# EAGLE design word_clock (EAGLE 7.4.0)
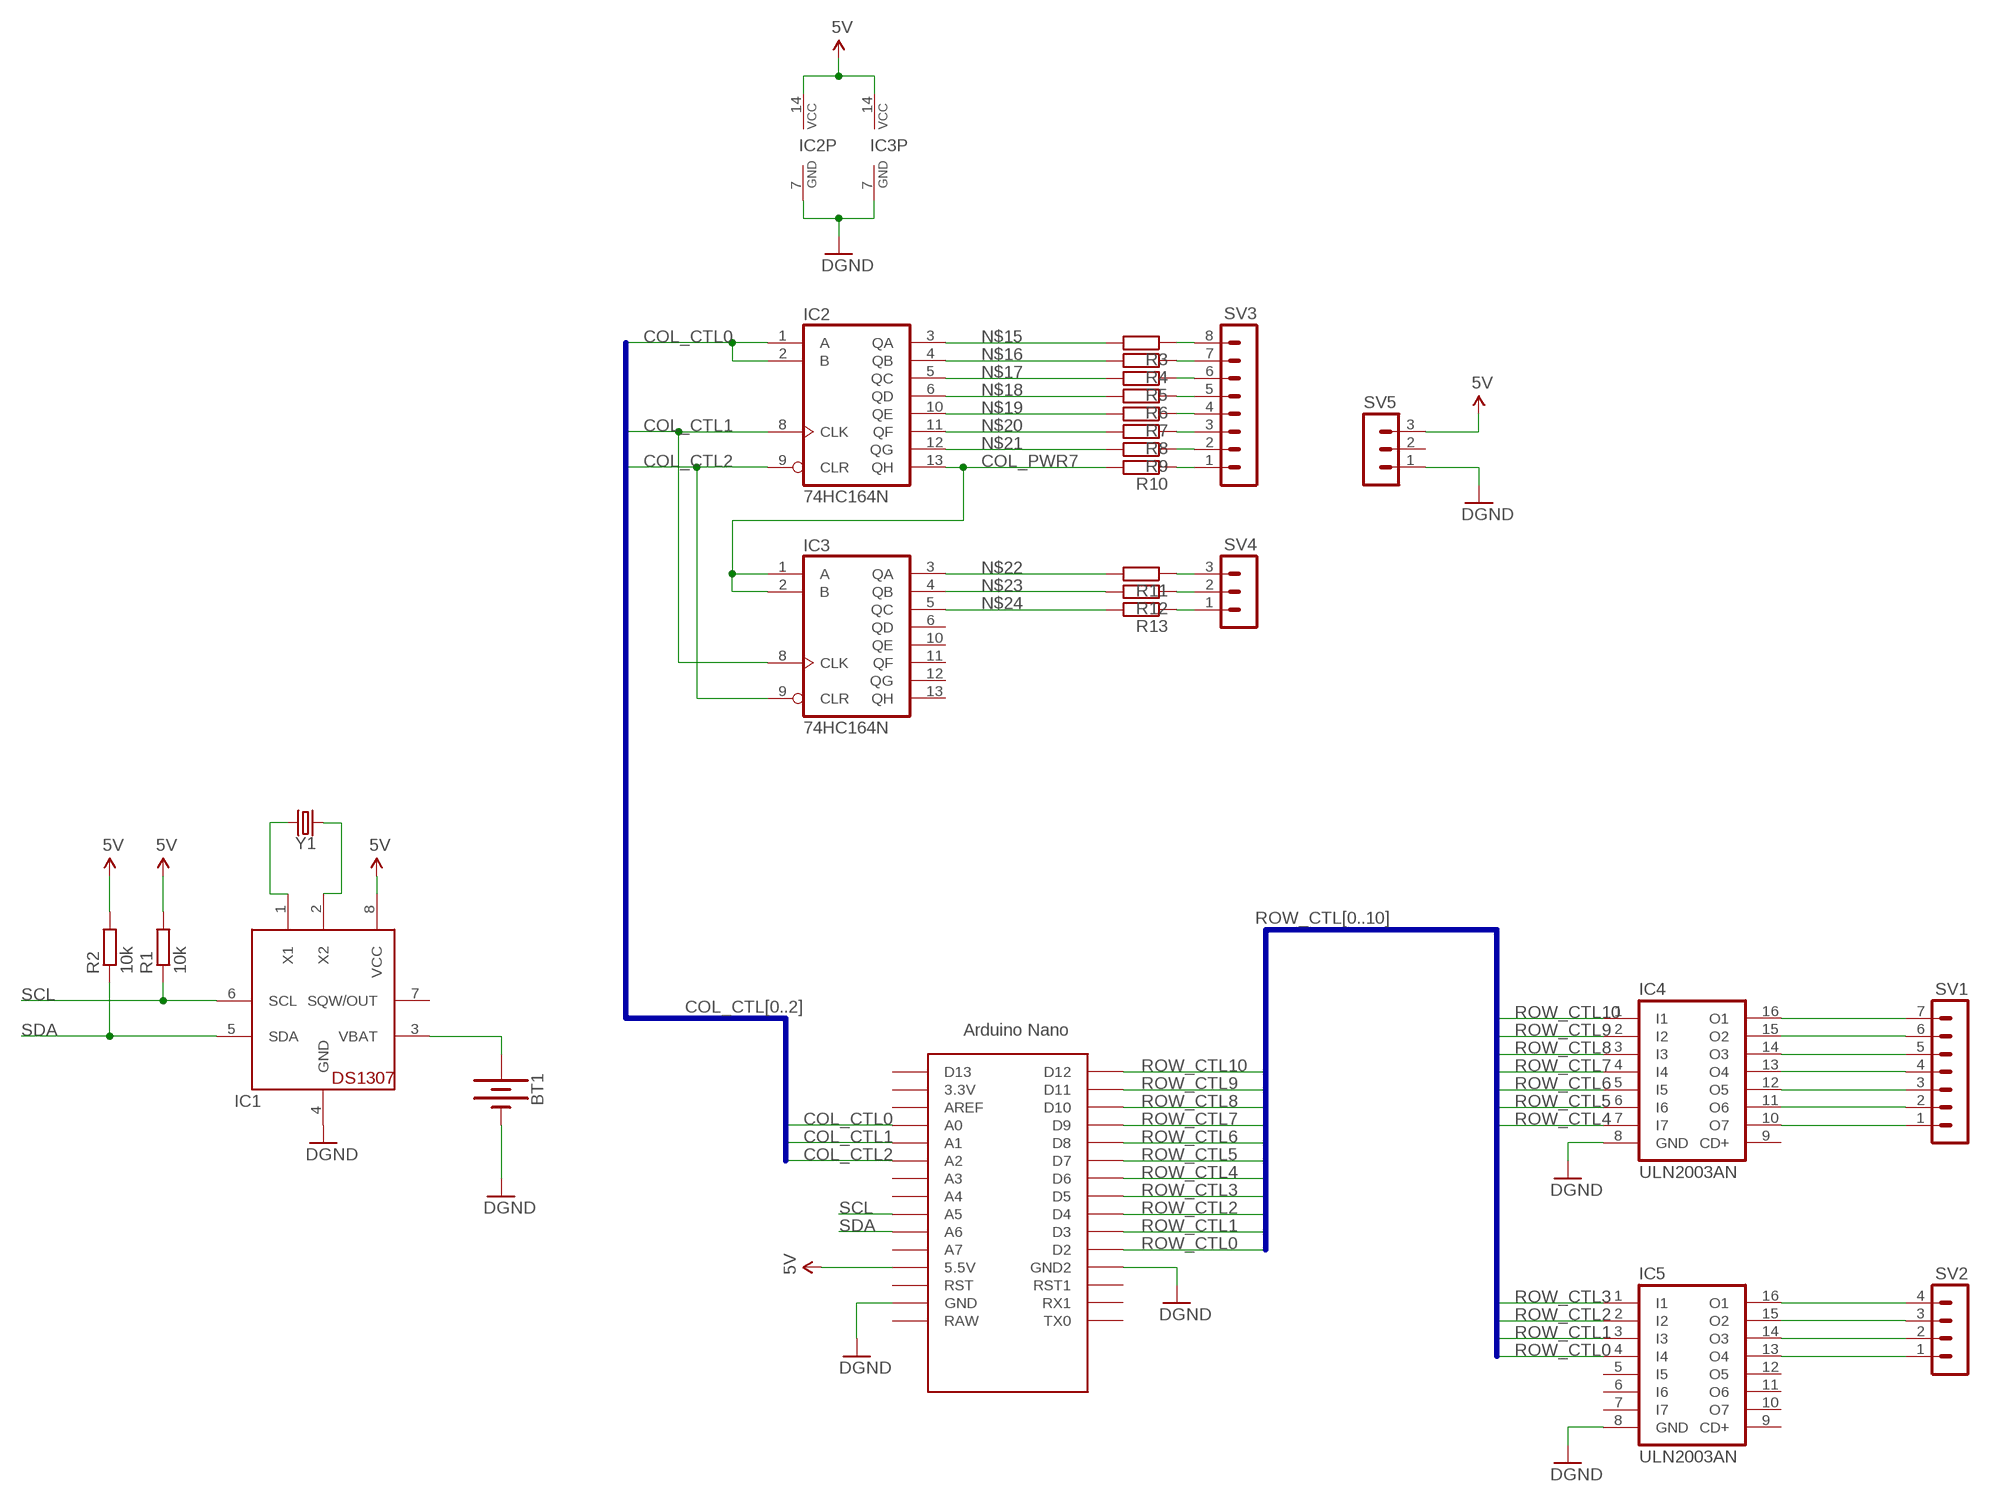
[diagram p0: schematic, sheet 1]

## Parts
BT1  BATTERY-20MM_PTH  [BATTCOM_20MM_PTH]
IC1  DS1307  [DIL08]
IC2  74HC164N  [DIL14]
IC3  74HC164N  [DIL14]
IC4  ULN2003AN  [DIL16]
IC5  ULN2003AN  [DIL16]
R1  10k  R-EU_0207/10  [0207/10]
R2  10k  R-EU_0207/10  [0207/10]
R3  R-EU_0207/10  [0207/10]
R4  R-EU_0207/10  [0207/10]
R5  R-EU_0207/10  [0207/10]
R6  R-EU_0207/10  [0207/10]
R7  R-EU_0207/10  [0207/10]
R8  R-EU_0207/10  [0207/10]
R9  R-EU_0207/10  [0207/10]
R10  R-EU_0207/10  [0207/10]
R11  R-EU_0207/10  [0207/10]
R12  R-EU_0207/10  [0207/10]
R13  R-EU_0207/10  [0207/10]
SV1  MA07-1  [MA07-1]
SV2  MA04-1  [MA04-1]
SV3  MA08-1  [MA08-1]
SV4  MA03-1  [MA03-1]
SV5  MA03-1  [MA03-1]
U$1  NANO_SHIELD  [NANO_SHIELD]
Y1  CRYSTALPTH-3X8  [CRYSTAL-PTH-3X8-CYL]

## Nets
5V: IC1.8(VCC) IC2.14(VCC) IC3.14(VCC) R1.2 R2.2 SV5.3 U$1.5V(5.5V)
COL_CTL0: IC2.1(A) IC2.2(B) U$1.A0
COL_CTL1: IC2.8(CLK) IC3.8(CLK) U$1.A1
COL_CTL2: IC2.9(CLR) IC3.9(CLR) U$1.A2
COL_PWR7: IC2.13(QH) IC3.1(A) IC3.2(B) R10.2
GND: BT1.2(-) IC1.4(GND) IC2.7(GND) IC3.7(GND) IC4.8(GND) IC5.8(GND) SV5.1 U$1.GND U$1.GND1(GND2) ; supply symbol labelled DGND
N$1: IC1.1(X1) Y1.2
N$2: BT1.1(+) IC1.3(VBAT)
N$3: IC4.16(O1) SV1.7
N$4: IC4.15(O2) SV1.6
N$5: IC4.14(O3) SV1.5
N$6: IC4.13(O4) SV1.4
N$7: IC4.12(O5) SV1.3
N$8: IC4.11(O6) SV1.2
N$9: IC4.10(O7) SV1.1
N$10: IC5.16(O1) SV2.4
N$11: IC5.15(O2) SV2.3
N$12: IC5.14(O3) SV2.2
N$13: IC5.13(O4) SV2.1
N$14: IC1.2(X2) Y1.1
N$15: IC2.3(QA) R3.2
N$16: IC2.4(QB) R4.2
N$17: IC2.5(QC) R5.2
N$18: IC2.6(QD) R6.2
N$19: IC2.10(QE) R7.2
N$20: IC2.11(QF) R8.2
N$21: IC2.12(QG) R9.2
N$22: IC3.3(QA) R11.2
N$23: IC3.4(QB) R12.2
N$24: IC3.5(QC) R13.2
N$25: R11.1 SV4.3
N$26: R12.1 SV4.2
N$27: R13.1 SV4.1
N$28: R10.1 SV3.1
N$29: R9.1 SV3.2
N$30: R8.1 SV3.3
N$31: R7.1 SV3.4
N$32: R6.1 SV3.5
N$33: R5.1 SV3.6
N$34: R4.1 SV3.7
N$35: R3.1 SV3.8
ROW_CTL0: IC5.4(I4) U$1.D2
ROW_CTL1: IC5.3(I3) U$1.D3
ROW_CTL2: IC5.2(I2) U$1.D4
ROW_CTL3: IC5.1(I1) U$1.D5
ROW_CTL4: IC4.7(I7) U$1.D6
ROW_CTL5: IC4.6(I6) U$1.D7
ROW_CTL6: IC4.5(I5) U$1.D8
ROW_CTL7: IC4.4(I4) U$1.D9
ROW_CTL8: IC4.3(I3) U$1.D10
ROW_CTL9: IC4.2(I2) U$1.D11
ROW_CTL10: IC4.1(I1) U$1.D12
SCL: IC1.6(SCL) R1.1 U$1.A5
SDA: IC1.5(SDA) R2.1 U$1.A6
Unconnected: IC1.7(SQW/OUT) IC3.6(QD) IC3.10(QE) IC3.11(QF) IC3.12(QG) IC3.13(QH) IC4.9(CD+) IC5.5(I5) IC5.6(I6) IC5.7(I7) IC5.9(CD+) IC5.10(O7) IC5.11(O6) IC5.12(O5) SV5.2 U$1.3.3V U$1.A3 U$1.A4 U$1.A7 U$1.AREF U$1.D13 U$1.RAW U$1.RST U$1.RST1 U$1.RX1 U$1.TX0

## Buses
ROW_CTL[0..10]
COL_CTL[0..2]

## Library data of the parts
BT1 = SparkFun-Batteries:BATTERY: Battery - Single Cell A variety of battery chemistries, sizes, and footprints. Device List: 20MM_PTH - Coin Cell Battery Holder - 20mm (PTH) <https://www.sparkfun.com/products/783> 20MM_PTH_KIT- Coin Cell battery Holder - 20 mm (PTH) <http://www.sparkfun.com/products/783>kit version with special mask 6.8MM_PTH - Coin Cell Battery Holder - 6.8MM(SMD) <https://www.digikey.com/product-detail/en/seiko-instruments/MS621FE-FL11E/728-1057-ND/1889208?WT.srch=1&gclid=CNOQ5a6LzdQCFZS2wAodXCkE0g> 12MM_SMD - Coin Cell Battery Holder - 12mm (SMD) <https://www.sparkfun.com/products/10592> 12MM_PTH - Coin Cell Battery Holder - 12mm (PTH) <https://www.sparkfun.com/products/7948> 20MM_SMD - 20mm Coin Cell Battery Holder (SMD) (2 legs) Used on the Big Time Watch Kit <https://www.sparkfun.com/products/11734> 20MM_SMD_4LEGS - Coin Cell Battery Holder - 20mm (SMD) <https://www.sparkfun.com/products/11892> 20MM_SMD_4LEGS_OVERPASTE - Coin Cell Battery Holder - 20mm (SMD) <https://www.sparkfun.com/products/11892> (Over-paste on the legs) 24.5MM_PTH - Coin Cell Battery Holder - 24.5mm (PTH) <https://www.sparkfun.com/products/8863> 9V - 9V Battery Holder - PC Mount Used on the SparkFun SparkPunk Sound Kit <https://www.sparkfun.com/products/11177> and SparkFun SparkPunk Sequencer Kit <https://www.sparkfun.com/products/12707> 18650 - Battery Holder - 18650 (PTH) <https://www.sparkfun.com/products/13113> AA - Battery Holder - 1xAA (PTH) <https://www.sparkfun.com/products/7949> AAA - Battery Holder - 1xAAA (PTH) <https://www.sparkfun.com/products/12718> AA_KIT - Battery Holder - 1xAA (PTH) <https://www.sparkfun.com/products/7949> Special kit package - pads only have exposed copper on one side of the board. AAA_KIT - Battery Holder - 1xAAA (PTH) <https://www.sparkfun.com/products/12718> Special kit package - pads only have exposed copper on one side of the board.; PROD_ID: BATT-09031; SF_SKU: PRT-00783
IC1 = adafruit:DS1307: DS1307 Real time clock (RTC) with battery backup ability. Talk to it via i2c
IC2 IC3 = 74xx-eu:74*164: 8-bit parallel out SHIFT REGISTER
IC4 IC5 = uln-udn:ULN2003A: DRIVER ARRAY
R1-R13 = rcl:R-EU_: RESISTOR, European symbol
SV1 = con-lstb:MA07-1: PIN HEADER; OC_FARNELL: unknown; OC_NEWARK: unknown
SV2 = con-lstb:MA04-1: PIN HEADER; OC_FARNELL: unknown; OC_NEWARK: unknown
SV3 = con-lstb:MA08-1: PIN HEADER; OC_FARNELL: unknown; OC_NEWARK: unknown
SV4 SV5 = con-lstb:MA03-1: PIN HEADER; OC_FARNELL: unknown; OC_NEWARK: unknown
U$1 = Arduino-clone:NANO_SHIELD: Arduino Nano
Y1 = SparkFun-Clocks:CRYSTAL: Crystals (Generic) These are passive quartz crystals, which can be used as a clock source for a microcontroller. Crystal's are two-terminal devices. They require external "load" capacitors to generate an oscillating signal.

## Board
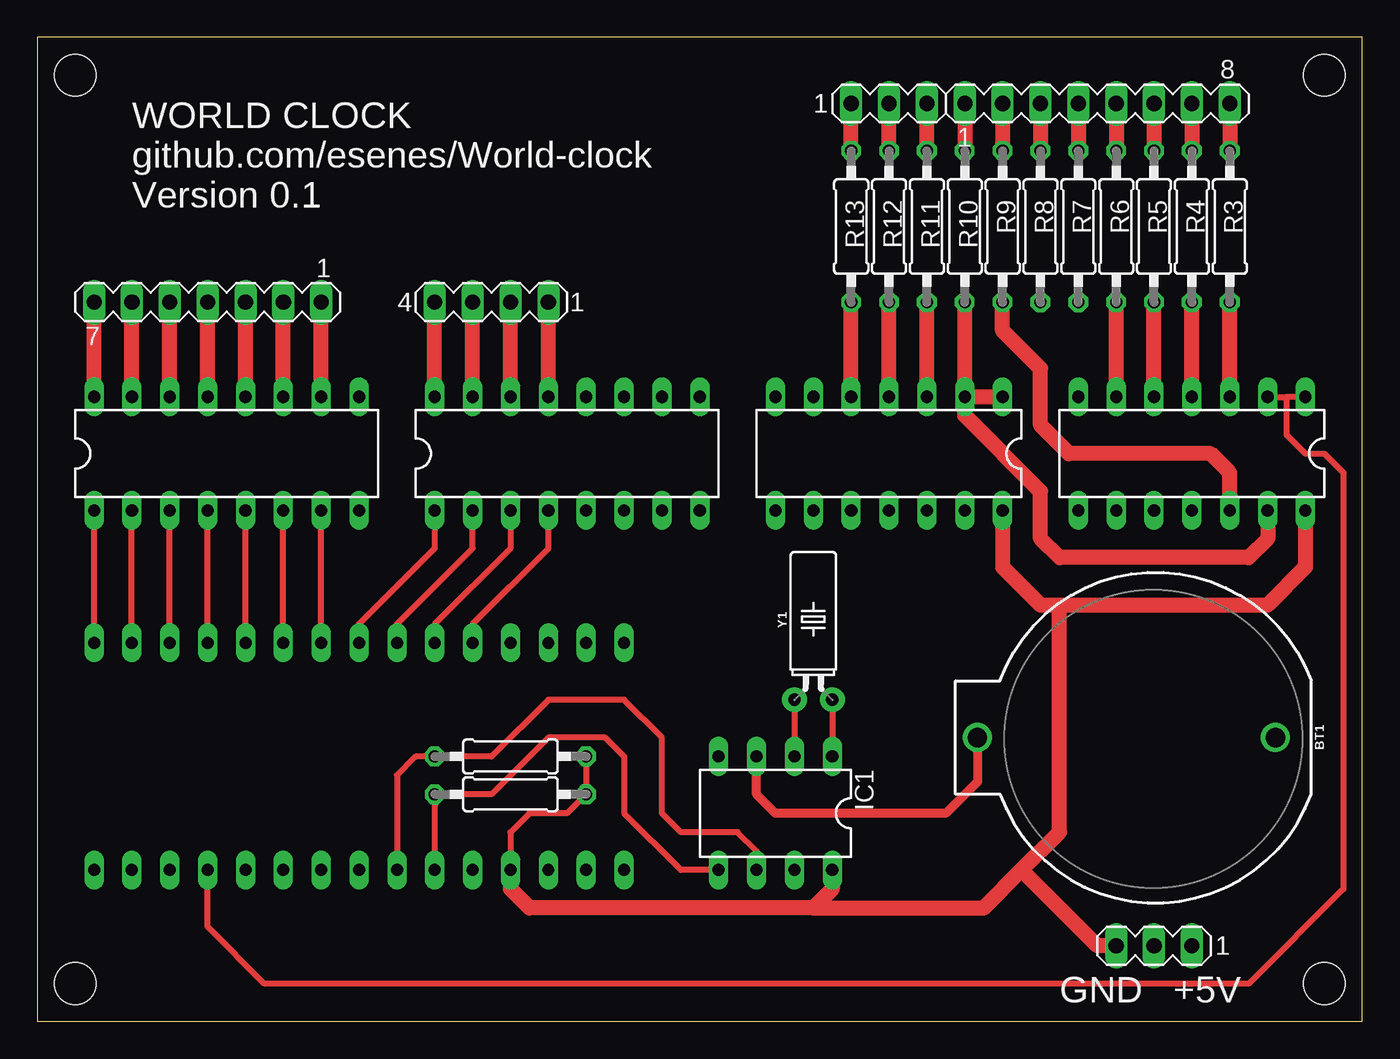
[diagram p1: board, top side]
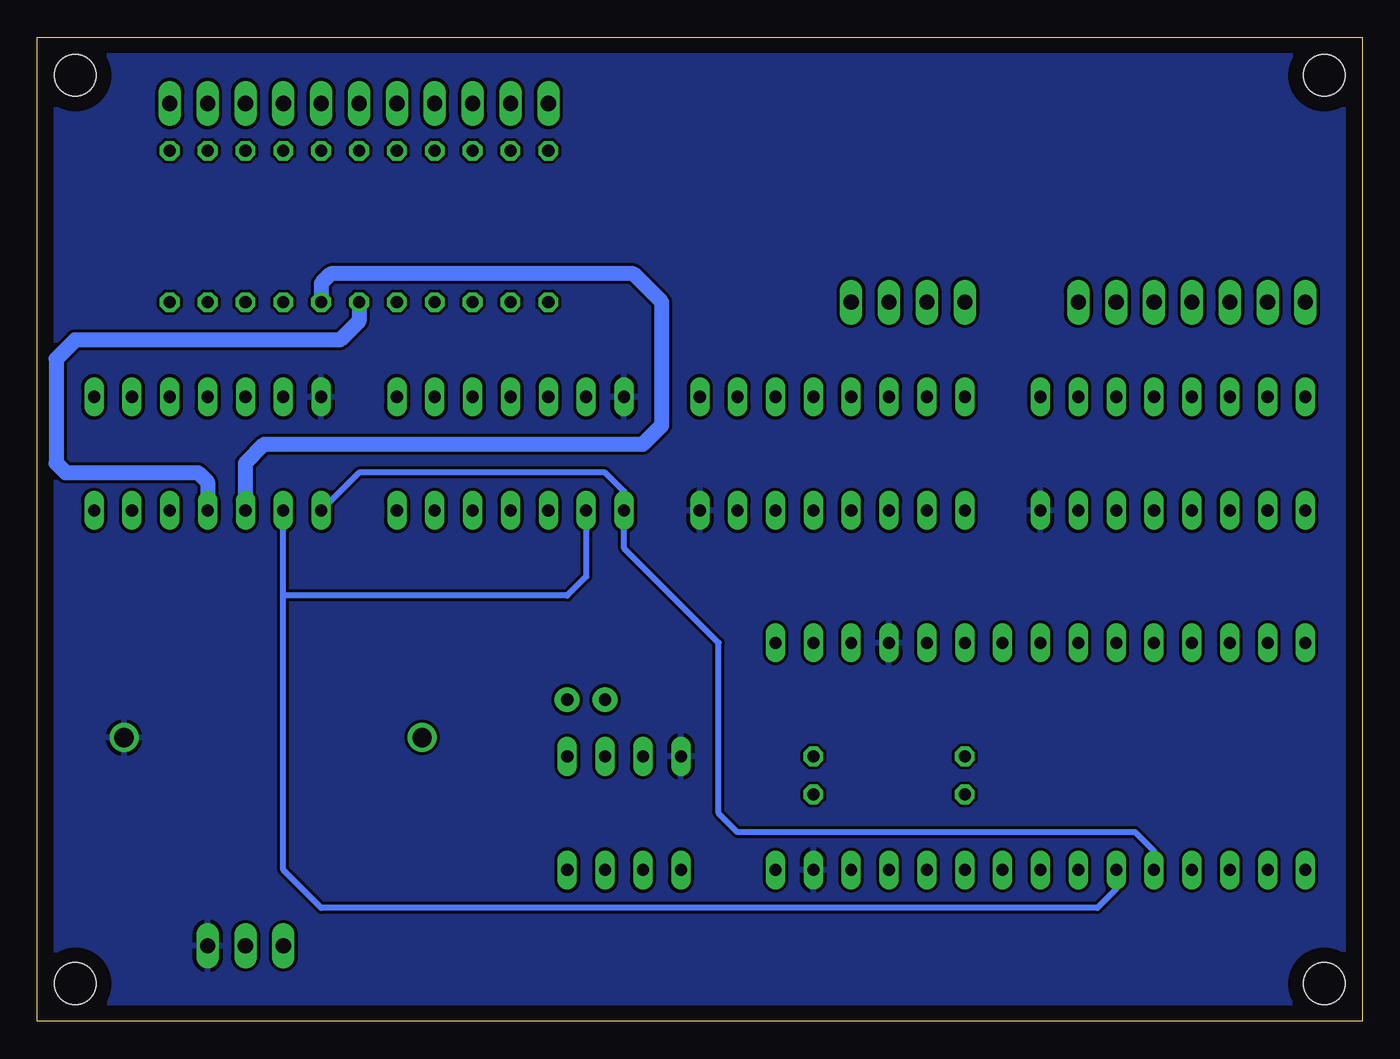
[diagram p2: board, bottom side, seen from below]

Size 88.9 x 66.04 mm. Coordinates in mm from the lower left corner, seen from the top.
Outline: 0,0 88.9,0 88.9,66.04 0,66.04 0,0
Copper layers (1*16): Top 0.035mm / dielectric 1.5mm / Bottom 0.035mm
Design rules "default": minimum track width 10mil, minimum drill 24mil, track to track 8mil, track to pad 8mil, pad to pad 8mil, via to via 8mil, smd to smd 8mil, copper to edge 40mil, drill to drill 8mil, minimum pad ring 10mil, minimum via ring 8mil, stop-mask expansion 4mil, vias tented up to drill 0mil, thermal gap 10mil
Holes 2.8 mm at 2.54,63.5 86.36,63.5 2.54,2.54 86.36,2.54

### Footprints (pad centres in the part's own frame; a part is rotated, then mirrored left to right if it is on the bottom)
BATTCOM_20MM_PTH = drill 1.3: 1 11.85,0; 2 -8.15,0
DIL08 = drill 0.813 long: 1 -3.81,-3.81; 2 -1.27,-3.81; 3 1.27,-3.81; 4 3.81,-3.81; 5 3.81,3.81; 6 1.27,3.81; 7 -1.27,3.81; 8 -3.81,3.81
DIL14 = drill 0.813 long: 1 -7.62,-3.81; 2 -5.08,-3.81; 3 -2.54,-3.81; 4 0,-3.81; 5 2.54,-3.81; 6 5.08,-3.81; 7 7.62,-3.81; 8 7.62,3.81; 9 5.08,3.81; 10 2.54,3.81; 11 0,3.81; 12 -2.54,3.81; 13 -5.08,3.81; 14 -7.62,3.81
DIL16 = drill 0.813 long: 1 -8.89,-3.81; 2 -6.35,-3.81; 3 -3.81,-3.81; 4 -1.27,-3.81; 5 1.27,-3.81; 6 3.81,-3.81; 7 6.35,-3.81; 8 8.89,-3.81; 9 8.89,3.81; 10 6.35,3.81; 11 3.81,3.81; 12 1.27,3.81; 13 -1.27,3.81; 14 -3.81,3.81; 15 -6.35,3.81; 16 -8.89,3.81
0207/10 = drill 0.813 octagon: 1 -5.08,0; 2 5.08,0
MA07-1 = drill 1.016 long: 1 -7.62,0; 2 -5.08,0; 3 -2.54,0; 4 0,0; 5 2.54,0; 6 5.08,0; 7 7.62,0
MA04-1 = drill 1.016 long: 1 -3.81,0; 2 -1.27,0; 3 1.27,0; 4 3.81,0
MA08-1 = drill 1.016 long: 1 -8.89,0; 2 -6.35,0; 3 -3.81,0; 4 -1.27,0; 5 1.27,0; 6 3.81,0; 7 6.35,0; 8 8.89,0
MA03-1 = drill 1.016 long: 1 -2.54,0; 2 0,0; 3 2.54,0
NANO_SHIELD = drill 0.8 long: 3.3V -10.16,24.13; 5V -10.16,-1.27; A0 -10.16,19.05; A1 -10.16,16.51; A2 -10.16,13.97; A3 -10.16,11.43; A4 -10.16,8.89; A5 -10.16,6.35; A6 -10.16,3.81; A7 -10.16,1.27; AREF -10.16,21.59; D2 5.08,1.27; D3 5.08,3.81; D4 5.08,6.35; D5 5.08,8.89; D6 5.08,11.43; D7 5.08,13.97; D8 5.08,16.51; D9 5.08,19.05; D10 5.08,21.59; D11 5.08,24.13; D12 5.08,26.67; D13 -10.16,26.67; GND -10.16,-6.35; GND1 5.08,-1.27; RAW -10.16,-8.89; RST -10.16,-3.81; RST1 5.08,-3.81; RX1 5.08,-6.35; TX0 5.08,-8.89
CRYSTAL-PTH-3X8-CYL = drill 0.813 pad 1.676: 1 -1.27,0; 2 1.27,0

### Placement (x,y rotation side)
BT1  74.93,19.05 180 top
IC1  49.53,13.97 180 top
IC2  77.47,38.1 180 top
IC3  57.15,38.1 180 top
IC4  12.7,38.1 0 top
IC5  35.56,38.1 0 top
R1  31.75,17.78 0 top
R2  31.75,15.24 0 top
R3  80.01,53.34 270 top
R4  77.47,53.34 270 top
R5  74.93,53.34 270 top
R6  72.39,53.34 270 top
R7  69.85,53.34 270 top
R8  67.31,53.34 270 top
R9  64.77,53.34 270 top
R10  62.23,53.34 270 top
R11  59.69,53.34 270 top
R12  57.15,53.34 270 top
R13  54.61,53.34 270 top
SV1  11.43,48.26 180 top
SV2  30.48,48.26 180 top
SV3  71.12,61.59 0 top
SV4  57.15,61.59 0 top
SV5  74.93,5.08 180 top
U$1  30.48,20.32 90 top
Y1  52.07,21.59 0 top

### Tracks (layer width: path | path; a pad name or v marks a point on that pad's centre or on a via)
5V
  Top 0.406: R1.2 R2.2 35.56,13.97 33.02,13.97 31.75,12.7 U$1.5V
  Top 1.016: 52.07,7.62 33.02,7.62 31.75,8.89 U$1.5V | IC2.14 85.09,30.48 82.55,27.94 68.58,27.94 | IC3.14 64.77,30.48 67.31,27.94 68.58,27.94 | IC1.8 53.34,8.89 52.07,7.62 | 52.07,7.62 63.5,7.62 66.04,10.16 | 66.04,10.16 68.58,12.7 68.58,27.94 | SV5.3 71.12,5.08 66.04,10.16
COL_CTL0
  Top 0.406: IC2.1 83.82,41.91 | IC2.2 83.82,41.91 | 83.82,41.91 83.82,39.37 85.09,38.1 86.36,38.1 87.63,36.83 87.63,8.89 81.28,2.54 15.24,2.54 11.43,6.35 U$1.A0
COL_CTL1
  Bottom 0.406: U$1.A1 13.97,11.43 15.24,12.7 41.91,12.7 43.18,13.97 43.18,25.4 49.53,31.75 IC3.8 49.53,35.56 50.8,36.83 67.31,36.83 IC2.8
COL_CTL2
  Bottom 0.406: U$1.A2 16.51,8.89 17.78,7.62 69.85,7.62 72.39,10.16 72.39,28.57 | 72.39,28.57 IC2.9 | IC3.9 52.07,29.84 53.34,28.57 72.39,28.57
COL_PWR7
  Top 1.016: IC3.1 IC3.2 | IC3.2 62.23,40.64 67.31,35.56 67.31,32.38 68.58,31.11 81.28,31.11 82.55,32.38 IC2.13 | IC3.2 R10.2
GND
  pour Bottom: 1.27,64.77 87.63,64.77 87.63,1.27 1.27,1.27
N$1
  Top 0.406: Y1.2 IC1.1
N$2
  Top 0.61: BT1.1 63.08,16.09 60.96,13.97 49.53,13.97 48.26,15.24 IC1.3
N$3
  Top 1.016: IC4.16 SV1.7
N$4
  Top 1.016: IC4.15 SV1.6
N$5
  Top 1.016: IC4.14 SV1.5
N$6
  Top 1.016: IC4.13 SV1.4
N$7
  Top 1.016: IC4.12 SV1.3
N$8
  Top 1.016: IC4.11 SV1.2
N$9
  Top 1.016: IC4.10 SV1.1
N$10
  Top 1.016: IC5.16 SV2.4
N$11
  Top 1.016: IC5.15 SV2.3
N$12
  Top 1.016: IC5.14 SV2.2
N$13
  Top 1.016: IC5.13 SV2.1
N$14
  Top 0.406: Y1.1 IC1.2
N$15
  Top 1.016: IC2.3 R3.2
N$16
  Top 1.016: IC2.4 R4.2
N$17
  Top 1.016: IC2.5 R5.2
N$18
  Top 1.016: IC2.6 R6.2
N$19
  Bottom 1.016: IC2.10 74.93,37.47 73.66,38.73 48.26,38.73 46.99,40.01 46.99,48.26 48.9,50.16 69.22,50.16 69.85,49.53 R7.2
N$20
  Bottom 1.016: R8.2 67.31,46.99 68.58,45.72 86.36,45.72 87.63,44.45 87.63,37.47 87,36.83 78.11,36.83 77.47,36.2 IC2.11
N$21
  Top 1.016: IC2.12 80.01,36.83 78.74,38.1 69.22,38.1 67.31,40.01 67.31,43.81 64.77,46.35 R9.2
N$22
  Top 1.016: IC3.3 R11.2
N$23
  Top 1.016: IC3.4 R12.2
N$24
  Top 1.016: IC3.5 R13.2
N$25
  Top 1.016: R11.1 SV4.3
N$26
  Top 1.016: R12.1 SV4.2
N$27
  Top 1.016: R13.1 SV4.1
N$28
  Top 1.016: SV3.1 R10.1
N$29
  Top 1.016: SV3.2 R9.1
N$30
  Top 1.016: SV3.3 R8.1
N$31
  Top 1.016: SV3.4 R7.1
N$32
  Top 1.016: SV3.5 R6.1
N$33
  Top 1.016: SV3.6 R5.1
N$34
  Top 1.016: SV3.7 R4.1
N$35
  Top 1.016: SV3.8 R3.1
ROW_CTL0
  Top 0.406: U$1.D2 29.21,26.67 34.29,31.75 IC5.4
ROW_CTL1
  Top 0.406: IC5.3 31.75,31.75 26.67,26.67 U$1.D3
ROW_CTL2
  Top 0.406: U$1.D4 24.13,26.67 29.21,31.75 IC5.2
ROW_CTL3
  Top 0.406: IC5.1 26.67,31.75 21.59,26.67 U$1.D5
ROW_CTL4
  Top 0.406: U$1.D6 IC4.7
ROW_CTL5
  Top 0.406: U$1.D7 IC4.6
ROW_CTL6
  Top 0.406: U$1.D8 IC4.5
ROW_CTL7
  Top 0.406: U$1.D9 IC4.4
ROW_CTL8
  Top 0.406: U$1.D10 IC4.3
ROW_CTL9
  Top 0.406: U$1.D11 IC4.2
ROW_CTL10
  Top 0.406: U$1.D12 IC4.1
SCL
  Top 0.406: U$1.A5 24.13,16.51 25.4,17.78 R1.1 30.48,17.78 34.29,21.59 39.37,21.59 41.91,19.05 41.91,13.97 43.18,12.7 46.99,12.7 48.26,11.43 IC1.6
SDA
  Top 0.406: U$1.A6 R2.1 30.48,15.24 34.29,19.05 38.1,19.05 39.37,17.78 39.37,13.97 43.18,10.16 IC1.5

### Text on the board
tPlace: WORLD CLOCK / github.com/esenes/World-clock / Version 0.1 | GND | +5V